# EAGLE design ESP_notifier (EAGLE 6.5.0)
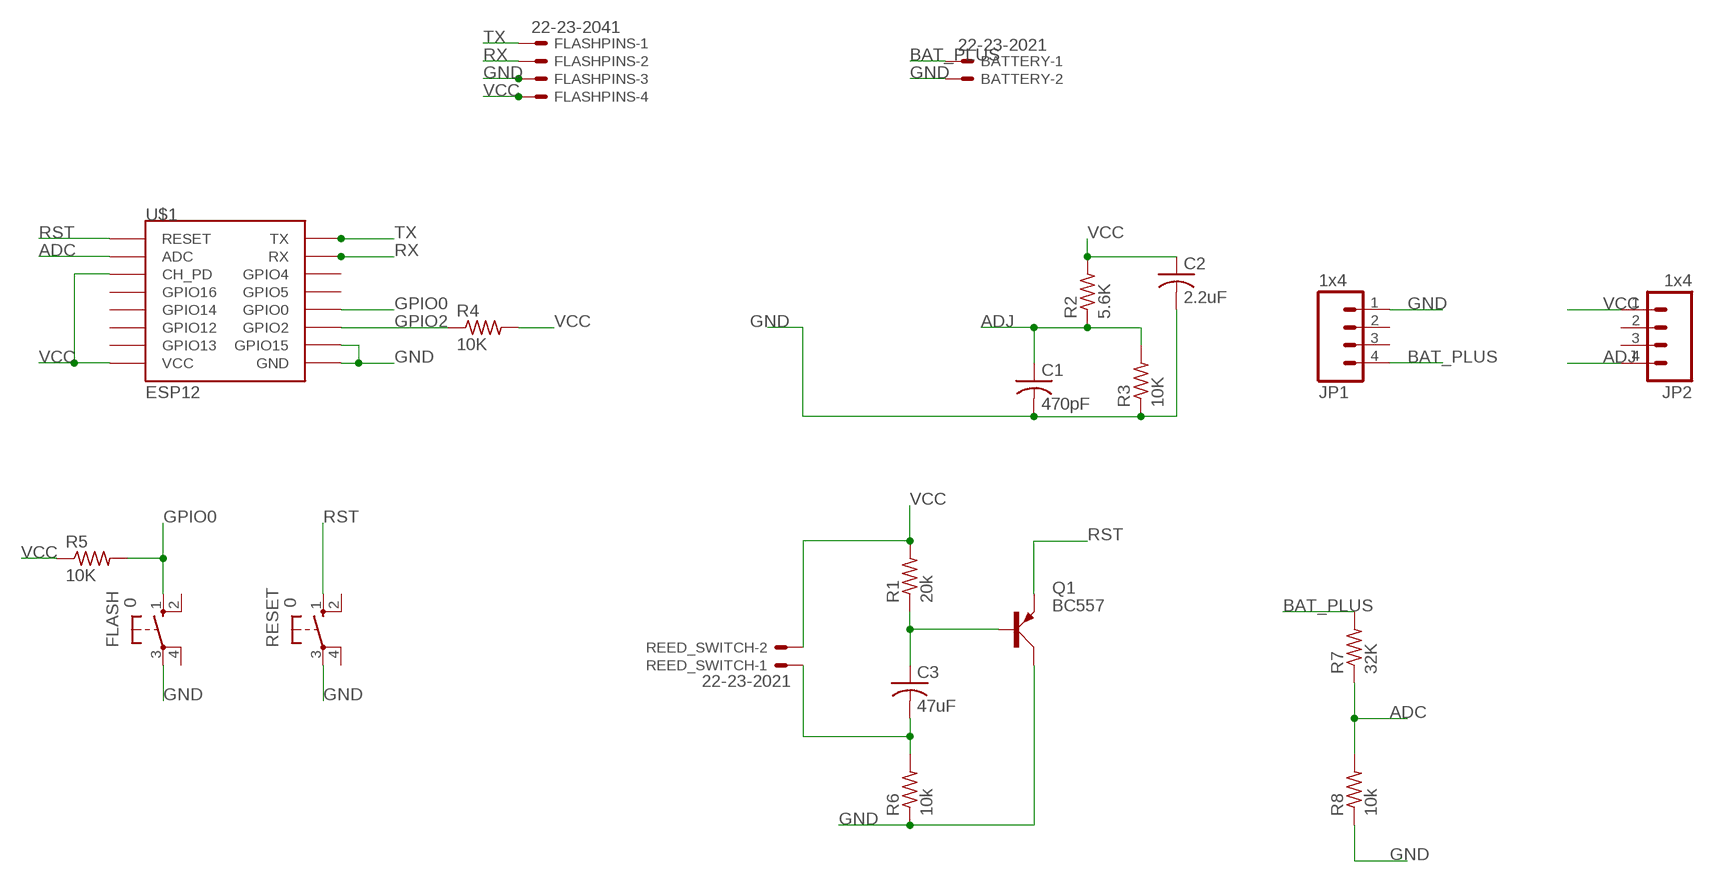
[diagram p0: schematic, sheet 1]

## Parts
BATTERY  22-23-2021  [22-23-2021]
C1  470pF  C-US075-032X103  [C075-032X103]
C2  2.2uF  C-US075-032X103  [C075-032X103]
C3  47uF  C-US075-032X103  [C075-032X103]
FLASH  0  10-XX  [B3F-10XX]
FLASHPINS  22-23-2041  [22-23-2041]
JP1  1x4  M041X04_NO_SILK  [1X04_NO_SILK]
JP2  1x4  M04NO_SILK_ALL_ROUND  [1X04_NO_SILK_ALL_ROUND]
Q1  BC557  [SOT54A]
R1  20k  R-US_0207/9  [0207/9]
R2  5.6K  R-US_0207/9  [0207/9]
R3  10K  R-US_0207/9  [0207/9]
R4  10K  R-US_0207/9  [0207/9]
R5  10K  R-US_0207/9  [0207/9]
R6  10k  R-US_0207/9  [0207/9]
R7  32K  R-US_0207/9  [0207/9]
R8  10k  R-US_0207/9  [0207/9]
REED_SWITCH  22-23-2021  [22-23-2021]
RESET  0  10-XX  [B3F-10XX]
U$1  ESP12  [ESP12]

## Nets
ADC: R7.1 R8.2 U$1.ADC
ADJ: C1.1 JP2.4 R2.1 R3.2
BAT_PLUS: BATTERY.1 JP1.4 R7.2
GND: BATTERY.2 C1.2 C2.2 FLASH.3(P) FLASHPINS.3 JP1.1 Q1.C R3.1 R6.1 R8.1 RESET.3(P) U$1.GND U$1.GPIO15
GPIO0: FLASH.1(S) R5.2 U$1.GPIO0
GPIO2: R4.1 U$1.GPIO2
N$1: C3.1 Q1.B R1.1
N$2: C3.2 R6.2 REED_SWITCH.1
RST: Q1.E RESET.1(S) U$1.RESET
RX: FLASHPINS.2 U$1.RX
TX: FLASHPINS.1 U$1.TX
VCC: C2.1 FLASHPINS.4 JP2.1 R1.2 R2.2 R4.2 R5.1 REED_SWITCH.2 U$1.CH_PD U$1.VCC
Unconnected: FLASH.2(S1) FLASH.4(P1) JP1.2 JP1.3 JP2.2 JP2.3 RESET.2(S1) RESET.4(P1) U$1.GPIO4 U$1.GPIO5 U$1.GPIO12 U$1.GPIO13 U$1.GPIO14 U$1.GPIO16

## Library data of the parts
BATTERY REED_SWITCH = con-molex:22-23-2021: .100" (2.54mm) Center Header - 2 Pin; MF: MOLEX; MPN: 22-23-2021; OC_FARNELL: 1462926; OC_NEWARK: 25C3832
C1-C3 = adafruit:C-US: CAPACITOR, American symbol
FLASH RESET = switch-omron:10-XX: OMRON SWITCH; MPN: B3F-1000; OC_FARNELL: 176432; OC_NEWARK: 36M3542
FLASHPINS = con-molex:22-23-2041: .100" (2.54mm) Center Header - 4 Pin; MF: MOLEX; MPN: 22-23-2041; OC_FARNELL: 1462920; OC_NEWARK: 38C0355
JP1 JP2 = SparkFun-Connectors:M04: Header 4 Standard 4-pin 0.1" header. Use with straight break away headers (SKU : PRT-00116), right angle break away headers (PRT-00553), swiss pins (PRT-00743), machine pins (PRT-00117), and female headers (PRT-00115). Molex polarized connector foot print use with SKU : PRT-08231 with associated crimp pins and housings. 1MM SMD Version SKU: PRT-10208
Q1 = transistor-small-signal:BC557: PNP TRANSISTOR
R1-R8 = adafruit:R-US_: RESISTOR, American symbol
U$1 = esp8266modules:ESP12: ESP8266 Wifi module 12

## Board
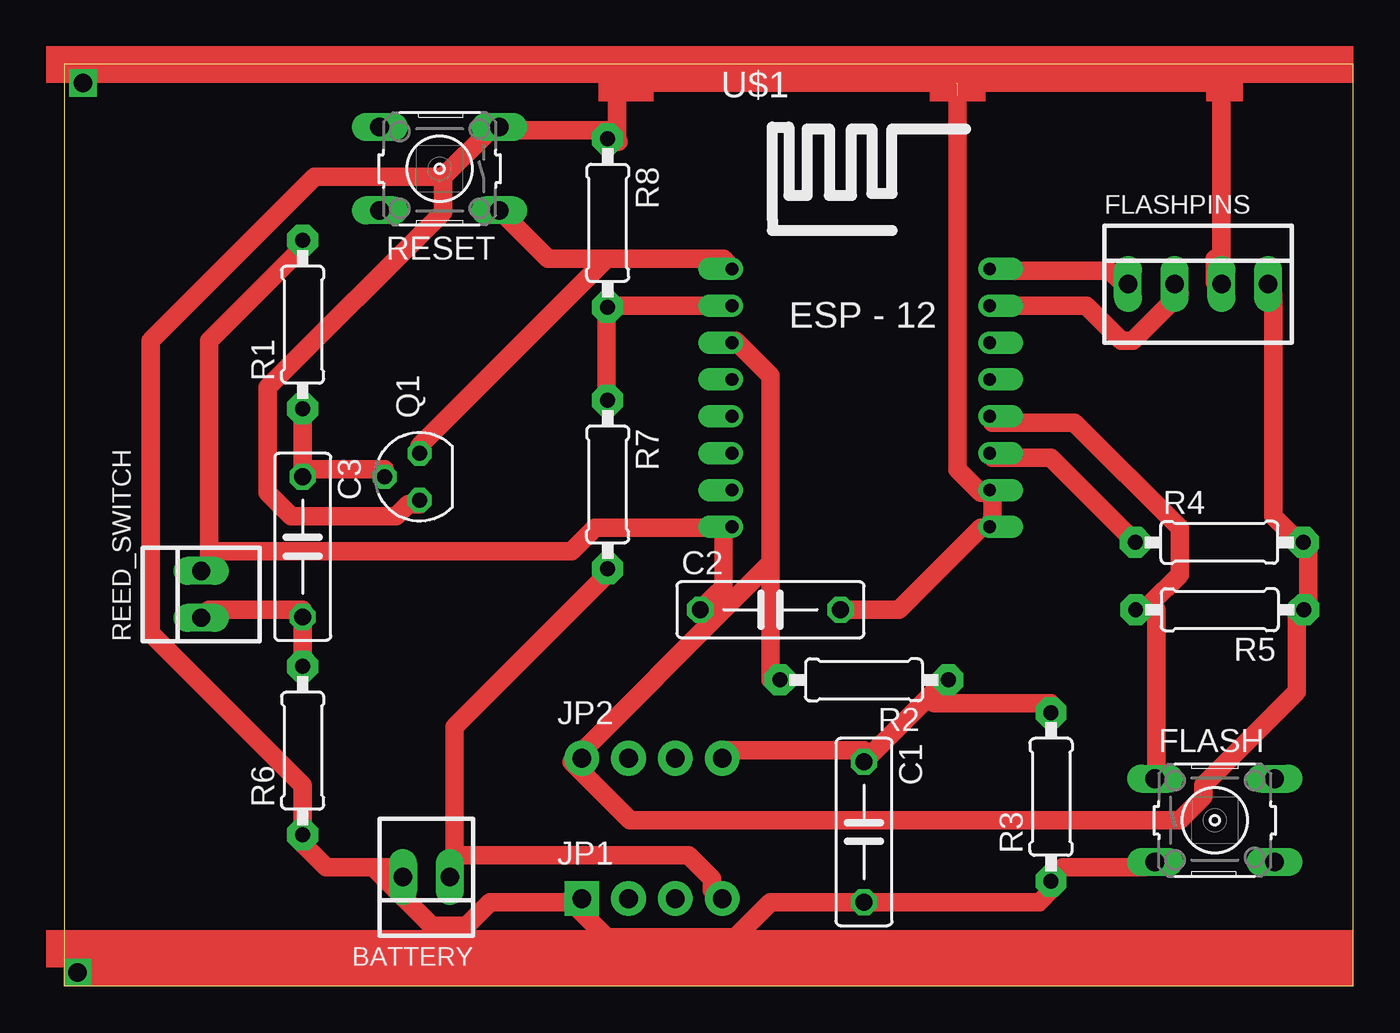
[diagram p1: board, top side]
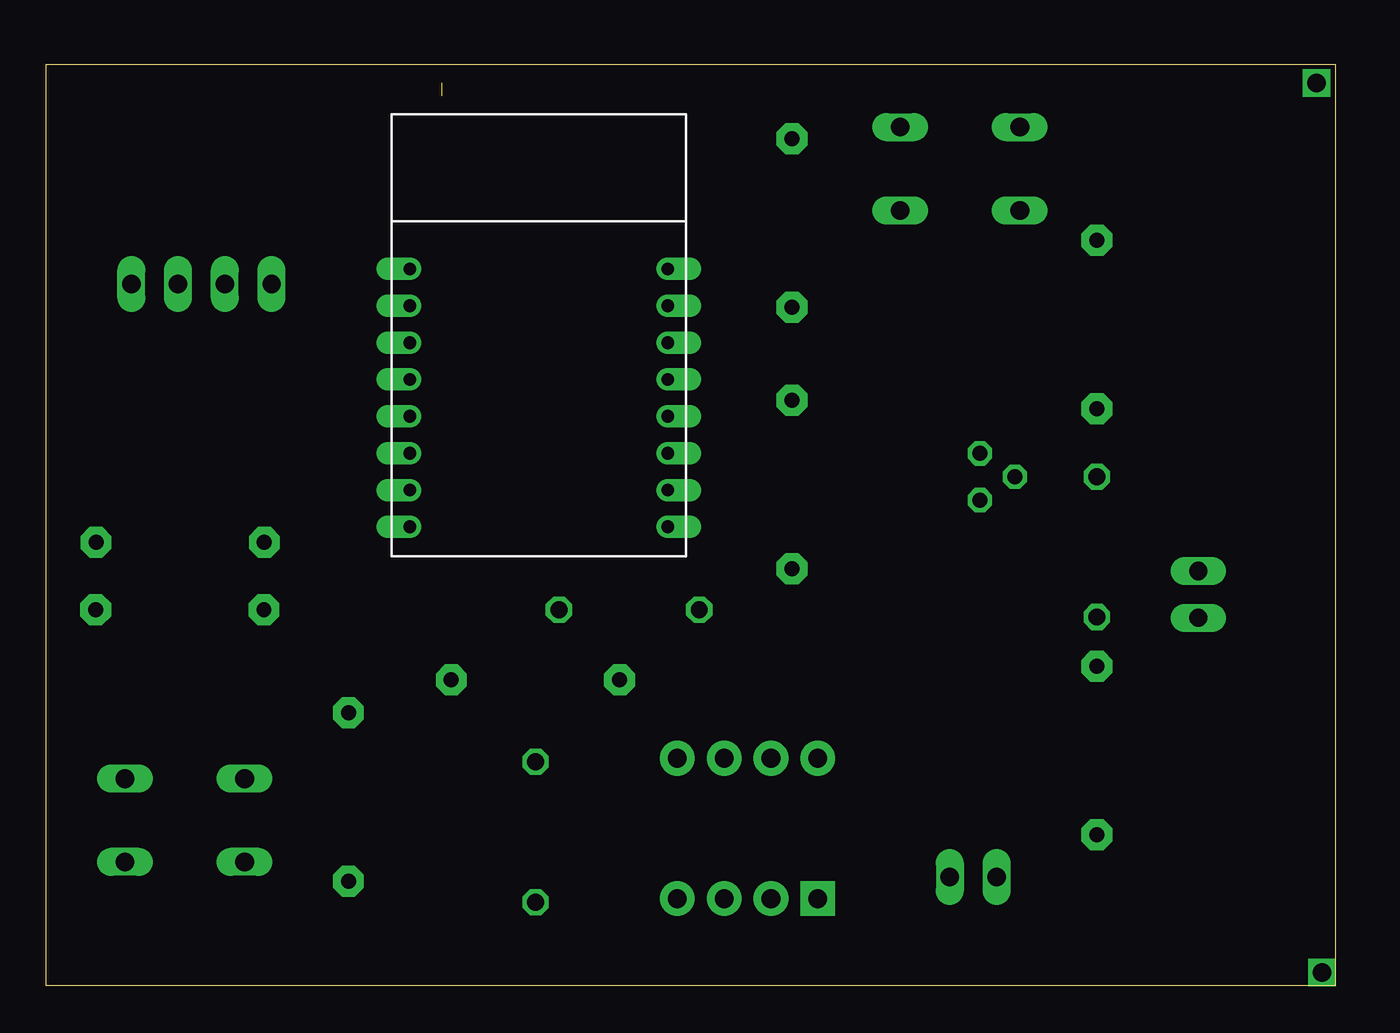
[diagram p2: board, bottom side, seen from below]

Size 70 x 50 mm. Coordinates in mm from the lower left corner, seen from the top.
Outline: 0,0 70,0 70,50 0,50 0,0
Copper layers (1*16): Top 0.035mm / dielectric 1.5mm / Bottom 0.035mm
Design rules "default *": minimum track width 40mil, minimum drill 24mil, track to track 20mil, track to pad 20mil, pad to pad 20mil, via to via 20mil, smd to smd 8mil, copper to edge 40mil, drill to drill 8mil, minimum pad ring 10mil, minimum via ring 8mil, stop-mask expansion 4mil, vias tented up to drill 0mil, thermal gap 10mil

### Footprints (pad centres in the part's own frame; a part is rotated, then mirrored left to right if it is on the bottom)
22-23-2021 = drill 1 long: 1 -1.27,0; 2 1.27,0
C075-032X103 = drill 0.914 octagon: 1 -3.81,0; 2 3.81,0
B3F-10XX = drill 1.016 long: 1 -3.251,2.261; 2 3.251,2.261; 3 -3.251,-2.261; 4 3.251,-2.261
22-23-2041 = drill 1 long: 1 -3.81,0; 2 -1.27,0; 3 1.27,0; 4 3.81,0
1X04_NO_SILK = drill 1.016 pad 1.88 square: 1 0,0 | drill 1.016 pad 1.88: 2 2.54,0; 3 5.08,0; 4 7.62,0
1X04_NO_SILK_ALL_ROUND = drill 1.016 pad 1.88: 1 0,0; 2 2.54,0; 3 5.08,0; 4 7.62,0
SOT54A = drill 0.813 octagon: B 0,1.905; C -1.27,0; E 1.27,0
0207/9 = drill 0.813 pad 1.676 octagon: 1 -4.572,0; 2 4.572,0
ESP12 = drill 0.7 offset: ADC -7.1,3.8; CH_PD -7.1,1.8; GND 6.9,-8.2; GPIO0 6.9,-2.2; GPIO2 6.9,-4.2; GPIO4 6.9,1.8; GPIO5 6.9,-0.2; GPIO12 -7.1,-4.2; GPIO13 -7.1,-6.2; GPIO14 -7.1,-2.2; GPIO15 6.9,-6.2; GPIO16 -7.1,-0.2; RESET -7.1,5.8; RX 6.9,3.8; TX 6.9,5.8; VCC -7.1,-8.2

### Placement (x,y rotation side)
BATTERY  19.66,5.89 180 top
C1  43.42,8.34 270 top
C2  38.34,20.4 0 top
C3  12.94,23.82 270 top
FLASH  62.47,8.97 0 top
FLASHPINS  61.56,38.08 0 top
JP1  28.09,4.72 0 top
JP2  28.09,12.34 0 top
Q1  19.29,27.62 90 top
R1  12.94,35.88 90 top
R2  43.42,16.59 180 top
R3  53.58,10.24 90 top
R4  62.72,24.05 0 top
R5  62.74,20.4 180 top
R6  12.94,12.75 90 top
R7  29.5,27.2 270 top
R8  29.5,41.4 270 top
REED_SWITCH  7.43,21.23 90 top
RESET  20.37,44.34 180 top
U$1  43.34,33.1 0 top

### Tracks (layer width: path | path; a pad name or v marks a point on that pad's centre or on a via)
ADC
  Top 1.016: U$1.ADC 35.8,36.91 30.09,36.91 R8.2 29.45,36.27 29.45,31.83 R7.1
ADJ
  Top 1.016: 46.91,15.64 47.87,16.59 R2.1 | 46.91,15.64 C1.1 43.42,12.78 35.8,12.78 JP2.4 | R3.2 53.58,15.32 47.23,15.32 46.91,15.64
BAT_PLUS
  Top 1.016: 21.2,7.06 21.2,14.05 29.45,22.3 R7.2 | 21.2,7.06 21.2,6.43 BATTERY.1 21.2,7.06 | 21.2,7.06 33.9,7.06 35.16,5.79 35.16,5.16 JP1.4
GND  (1 unrouted)
  Top 1.016: FLASH.3 58.66,6.43 54.22,6.43 53.58,5.79 R3.1 53.58,5.16 52.94,4.53 C1.2 38.34,4.53 36.44,2.62 29.45,2.62 27.55,4.53 | 16.75,6.43 14.21,6.43 12.94,7.7 R6.1 12.94,10.88 4.68,19.13 4.68,35.01 13.57,43.9 20.56,43.9 | 16.75,6.43 18.02,6.43 BATTERY.2 | 27.55,4.53 23.1,4.53 21.83,3.26 19.92,3.26 16.75,6.43 | 27.55,4.53 JP1.1 | 20.56,43.9 20.56,41.99 11.04,32.47 11.04,26.75 12.3,25.48 18.02,25.48 18.66,26.11 19.29,26.11 Q1.C | 20.56,43.9 23.1,46.44 RESET.3 23.73,46.44 29.45,46.44 R8.1 30.09,45.8 30,45.8 30,49 62.83,49 | C2.2 45.33,20.4 49.77,24.84 U$1.GND 50.41,25.48 50.41,26.75 U$1.GPIO15 49.77,26.75 48.5,28.02 48.5,48.3 | 62.47,39.45 62.47,38.18 FLASHPINS.3 62.83,49 | 63,49 62.83,49
GPIO0
  Top 1.016: 58.98,20.72 58.66,20.4 R5.2 | 58.98,20.72 60.56,22.3 60.56,24.84 54.85,30.56 50.41,30.56 U$1.GPIO0 | FLASH.1 59.3,11.51 59.3,20.4 58.98,20.72
GPIO2
  Top 1.016: U$1.GPIO2 50.41,28.66 53.58,28.66 58.03,24.21 R4.1
N$1
  Top 1.016: 12.94,28.02 17.38,28.02 Q1.B | 12.94,28.02 R1.1 | 12.94,28.02 C3.1
N$2
  Top 1.016: R6.2 C3.2 12.94,20.4 7.86,20.4 REED_SWITCH.1
N$3  (via drill 1)
  other vias: 0.7,0.7
N$4  (via drill 1)
  other vias: 1,49
RST
  Top 1.016: 29.45,39.45 26.27,39.45 23.73,41.99 RESET.1 | 29.45,39.45 35.8,39.45 U$1.RESET | 29.45,39.45 19.29,29.29 Q1.E
RX
  Top 1.016: U$1.RX 50.41,36.91 55.48,36.91 57.39,35.01 58.03,35.01 60.56,37.55 FLASHPINS.2
TX
  Top 1.016: U$1.TX 50.41,38.81 56.75,38.81 57.39,38.18 FLASHPINS.1
VCC
  Top 1.016: 7.86,23.57 7.86,35.01 12.94,40.09 R1.2 | 7.86,23.57 7.86,22.94 REED_SWITCH.2 | FLASHPINS.4 65.64,37.55 65.64,25.48 66.92,24.21 R4.2 67.55,23.57 67.55,20.4 R5.1 66.92,20.4 66.92,15.95 61.83,10.88 61.83,10.24 60.56,8.97 30.72,8.97 27.55,12.14 JP2.1 28.18,12.78 36.12,20.72 | 35.8,24.84 35.8,21.67 35.48,21.35 | C2.1 35.48,21.35 | 38.34,22.94 38.34,16.59 R2.2 | 38.34,22.94 38.34,33.1 36.44,35.01 U$1.CH_PD | 38.34,22.94 36.12,20.72 | 35.48,21.35 35.8,21.04 36.12,20.72 | 7.86,23.57 27.55,23.57 28.81,24.84 35.8,24.84 | 35.8,24.84 U$1.VCC
(copper drawn outside any net)
  shapes: Top area x7